# Altium schematic sheet ch32v003f4p6.SchDoc
size A
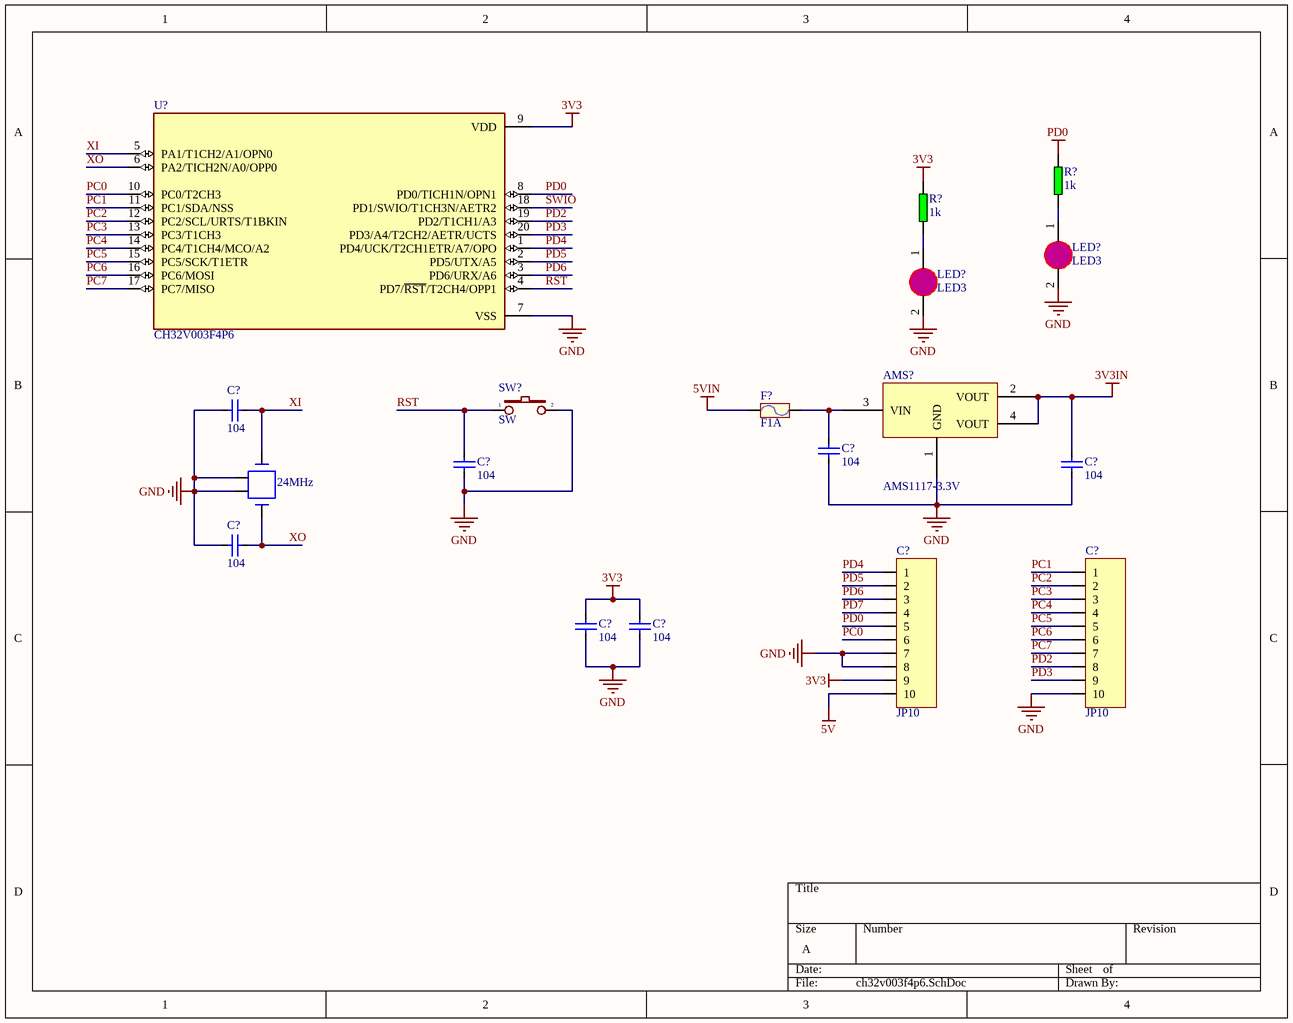
[diagram p0: ch32v003f4p6.SchDoc]

## Parts
(Parts that share a designator on the sheet are numbered #1, #2 ... from top to bottom, then left to right.)
AMS?  AMS1117-3.3V  [SOT223]
C?#1  104  [CAP_0402]
C?#2  104  [CAP_0402]
C?#3  104  [CAP_0402]
C?#4  104  [CAP_0402]
C?#5  104  [CAP_0402]
C?#6  JP10  [JP10-C1T]
C?#7  JP10  [JP10-C1T]
C?#8  104  [CAP_0402]
C?#9  104  [CAP_0402]
F?  F1A  [Fuse]
LED?#1  LED3  [LED0805]
LED?#2  LED3  [LED0805]
R?#1  1k  [SM-1206]
R?#2  1k  [SM-1206]
SW?  SW  [SW2]
U?  CH32V003F4P6  [SOP65P640X121-20N]
Y?  24MHz  [Crystal 4 pin SMD 50x32]

## Nets
3V3: C?#6.9 C?#8.2 C?#9.2 R?#2.2 U?.9(VDD)
3V3IN: AMS?.2(VOUT) AMS?.4(VOUT) C?#4.2
5V: C?#6.10
5VIN: F?.1
GND: AMS?.1(GND) C?#1.1 C?#2.1 C?#3.1 C?#4.1 C?#5.1 C?#6.7 C?#6.8 C?#7.10 C?#8.1 C?#9.1 LED?#1.2(K) LED?#2.2(K) SW?.2 U?.7(VSS) Y?.2(GND) Y?.4(GND)
PD0: C?#6.5 R?#1.2 U?.8(PD0/TICH1N/OPN1)
PC0: C?#6.6 U?.10(PC0/T2CH3)
PC1: C?#7.1 U?.11(PC1/SDA/NSS)
PC2: C?#7.2 U?.12(PC2/SCL/URTS/T1BKIN)
PC3: C?#7.3 U?.13(PC3/T1CH3)
PC4: C?#7.4 U?.14(PC4/T1CH4/MCO/A2)
PC5: C?#7.5 U?.15(PC5/SCK/T1ETR)
PC6: C?#7.6 U?.16(PC6/MOSI)
PC7: C?#7.7 U?.17(PC7/MISO)
PD2: C?#7.8 U?.19(PD2/T1CH1/A3)
PD3: C?#7.9 U?.20(PD3/A4/T2CH2/AETR/UCTS)
PD4: C?#6.1 U?.1(PD4/UCK/T2CH1ETR/A7/OPO)
PD5: C?#6.2 U?.2(PD5/UTX/A5)
PD6: C?#6.3 U?.3(PD6/URX/A6)
PD7: C?#6.4
RST: C?#3.2 SW?.1 U?.4(PD7/~{RST}/T2CH4/OPP1)
SWIO: U?.18(PD1/SWIO/T1CH3N/AETR2)
XI: C?#1.2 U?.5(PA1/T1CH2/A1/OPN0) Y?.1(OSC1)
XO: C?#5.2 U?.6(PA2/TICH2N/A0/OPP0) Y?.3(OSC2)
NetAMS?_3: AMS?.3(VIN) C?#2.2 F?.2
NetLED?#1_1: LED?#1.1(A) R?#1.1
NetLED?#2_1: LED?#2.1(A) R?#2.1

## Library data of the parts
AMS? = AMS1117 SMD: Dán; Value: AMS1117-3.3V SOT223; Don_Vi: Con; Ma_Hang: MH000596; Ghi_Chu: *; Kieu_Chan: *; Chung_Loai: Dán
C?#1-C?#5 C?#8 C?#9 = CapSMD: Capacitor; Value: 33p; Published: 8-Jun-2000; LatestRevisionDate: 17-Jul-2002; LatestRevisionNote: Re-released for DXP Platform.; PackageReference: RAD-0.3; Publisher: Altium Limited
C?#6 C?#7 = JP10: WR-PHD 2.54 mm Angled Socket Header; Manufacturer: W¨¹rth Elektronik eiSos GmbH; partNo: 613010143121; ComponentLink1 Description: Manufacturer; ComponentLink2 Description: Datasheet; NoPins: 10; Created Date: 29 March 2013; ComponentLink1URL: http://www.we-online.com; ComponentLink2URL: http://katalog.we-online.de/em/datasheet/6130xx143121.pdf; Created by: Karrer Zheng
F? = Fuse: Designed by: VanDungEvn; Value: Fuse
LED?#1 LED?#2 = LED0805: LED SMD 0805
R?#1 R?#2 = RES: Resistor 1/4W; Value: R1/4W - 1K
SW? = SW2: Switch button 2 pin; Value: SW chip 2 pin
U? = CH32V003F4P6: Industrial-grade general-purpose microcontroller; MF: WCH; SnapEDA_Link: https://www.snapeda.com/parts/CH32V003F4P6/WCH/view-part/?ref=snap; Package: Package; Value: *; MP: CH32V003F4P6; Check_prices: https://www.snapeda.com/parts/CH32V003F4P6/WCH/view-part/?ref=eda
Y? = XTAL_4Pin SMD: Crystal Oscillator; Published: 8-Jun-2000; LatestRevisionDate: 17-Jul-2002; LatestRevisionNote: Re-released for DXP Platform.; PackageReference: R38; Publisher: Altium Limited